# EAGLE design sensor (EAGLE 6.4)
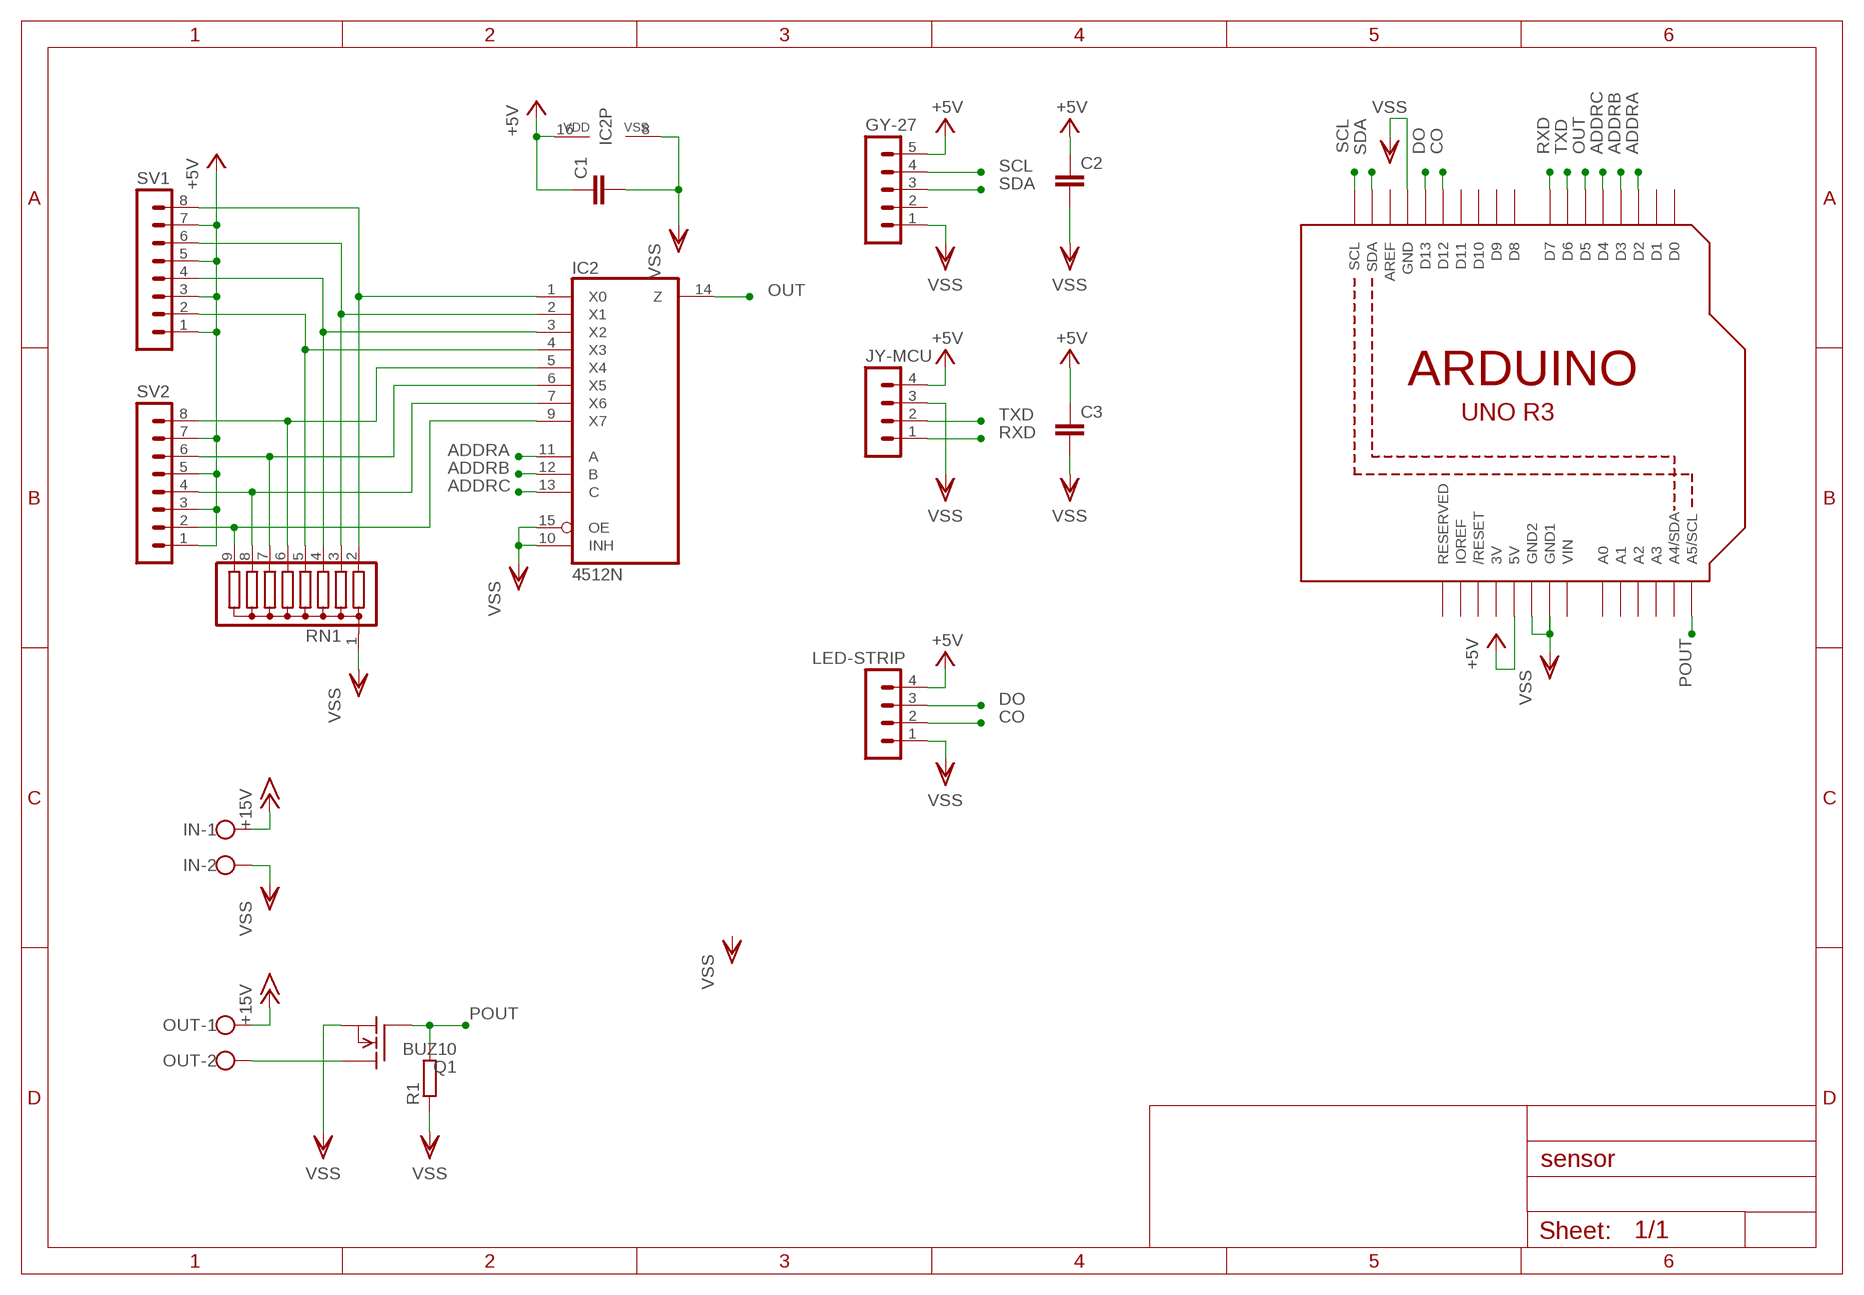
[diagram p0: schematic, sheet 1]

## Parts
C1  C-EUC0805  [C0805]
C2  C-EUC0805  [C0805]
C3  C-EUC0805  [C0805]
GY-27  MA05-1  [MA05-1]
IC2  4512N  [DIL16]
IN  W237-102  [W237-102]
JY-MCU  MA04-1  [MA04-1]
LED-STRIP  MA04-1  [MA04-1]
OUT  W237-102  [W237-102]
Q1  BUZ10  [TO220]
R1  R-EU_M0805  [M0805]
RN1  G08R  [SIL9]
SV1  MA08-1W  [MA08-1W]
SV2  MA08-1W  [MA08-1W]
U1  ARDUINOR3-DIMENSION  [ARDUINOR3]

## Nets
+5V: C1.1 C2.1 C3.1 GY-27.5 IC2.16(VDD) JY-MCU.4 LED-STRIP.4 SV1.1 SV1.3 SV1.5 SV1.7 SV2.1 SV2.3 SV2.5 SV2.7 U1.5V
+15V: IN.1 OUT.1
ADDRA: IC2.11(A) U1.D2
ADDRB: IC2.12(B) U1.D3
ADDRC: IC2.13(C) U1.D4
CO: LED-STRIP.2 U1.D12
DO: LED-STRIP.3 U1.D13
N$1: IC2.5(X4) RN1.6 SV2.8
N$2: IC2.4(X3) RN1.5 SV1.2
N$3: IC2.3(X2) RN1.4 SV1.4
N$4: IC2.6(X5) RN1.7 SV2.6
N$5: IC2.2(X1) RN1.3 SV1.6
N$6: IC2.1(X0) RN1.2 SV1.8
N$7: IC2.9(X7) RN1.9 SV2.2
N$9: IC2.7(X6) RN1.8 SV2.4
N$13: OUT.2 Q1.2(D)
OUT: IC2.14(Z) U1.D5
POUT: Q1.1(G) R1.2 U1.A5(A5/SCL)
RXD: JY-MCU.1 U1.D7
SCL: GY-27.4 U1.SCL
SDA: GY-27.3 U1.SDA
TXD: JY-MCU.2 U1.D6
VSS: C1.2 C2.2 C3.2 GY-27.1 IC2.8(VSS) IC2.10(INH) IC2.15(OE) IN.2 JY-MCU.3 LED-STRIP.1 Q1.3(S) R1.1 RN1.1 U1.GND U1.GND1 U1.GND2
Unconnected: GY-27.2 U1.A0 U1.A1 U1.A2 U1.A3 U1.A4(A4/SDA) U1.AREF U1.D0 U1.D1 U1.D8 U1.D9 U1.D10 U1.D11 U1.IOREF U1.RESERVED U1.RESET(/RESET)

## Power pins joined to a net without a drawn wire
3V: U1.3V
VIN: U1.VIN

## Library data of the parts
C1-C3 = rcl:C-EU: CAPACITOR, European symbol
GY-27 = con-lstb:MA05-1: PIN HEADER; OC_FARNELL: unknown; OC_NEWARK: unknown
IC2 = 45xx:4512: 8-channel DATA SELECTOR Inhibit function corrected - 2005.10.04 librarian@cadsoft.de
IN OUT = con-wago-500:W237-102: WAGO SCREW CLAMP; MPN: 237-102; OC_FARNELL: unknown; OC_NEWARK: 70K9898
JY-MCU LED-STRIP = con-lstb:MA04-1: PIN HEADER; OC_FARNELL: unknown; OC_NEWARK: unknown
Q1 = transistor-fet:BUZ10: N-Channel Enhancement MOSFET 50V; 20A; 0,080Ohm
R1 = rcl:R-EU_: RESISTOR, European symbol
RN1 = resistor-sil:G08R: SIL RESISTOR; OC_FARNELL: unknown; OC_NEWARK: unknown
SV1 SV2 = con-lstb:MA08-1W: PIN HEADER; OC_FARNELL: unknown; OC_NEWARK: unknown
U1 = adafruit:ARDUINOR3: This is a new object for the new Arduino R3 - with extra pins that you may want to use (such as IOref, and duplicated A4/A5

## Net classes
0 default: clearance 0.355 mm

## Board
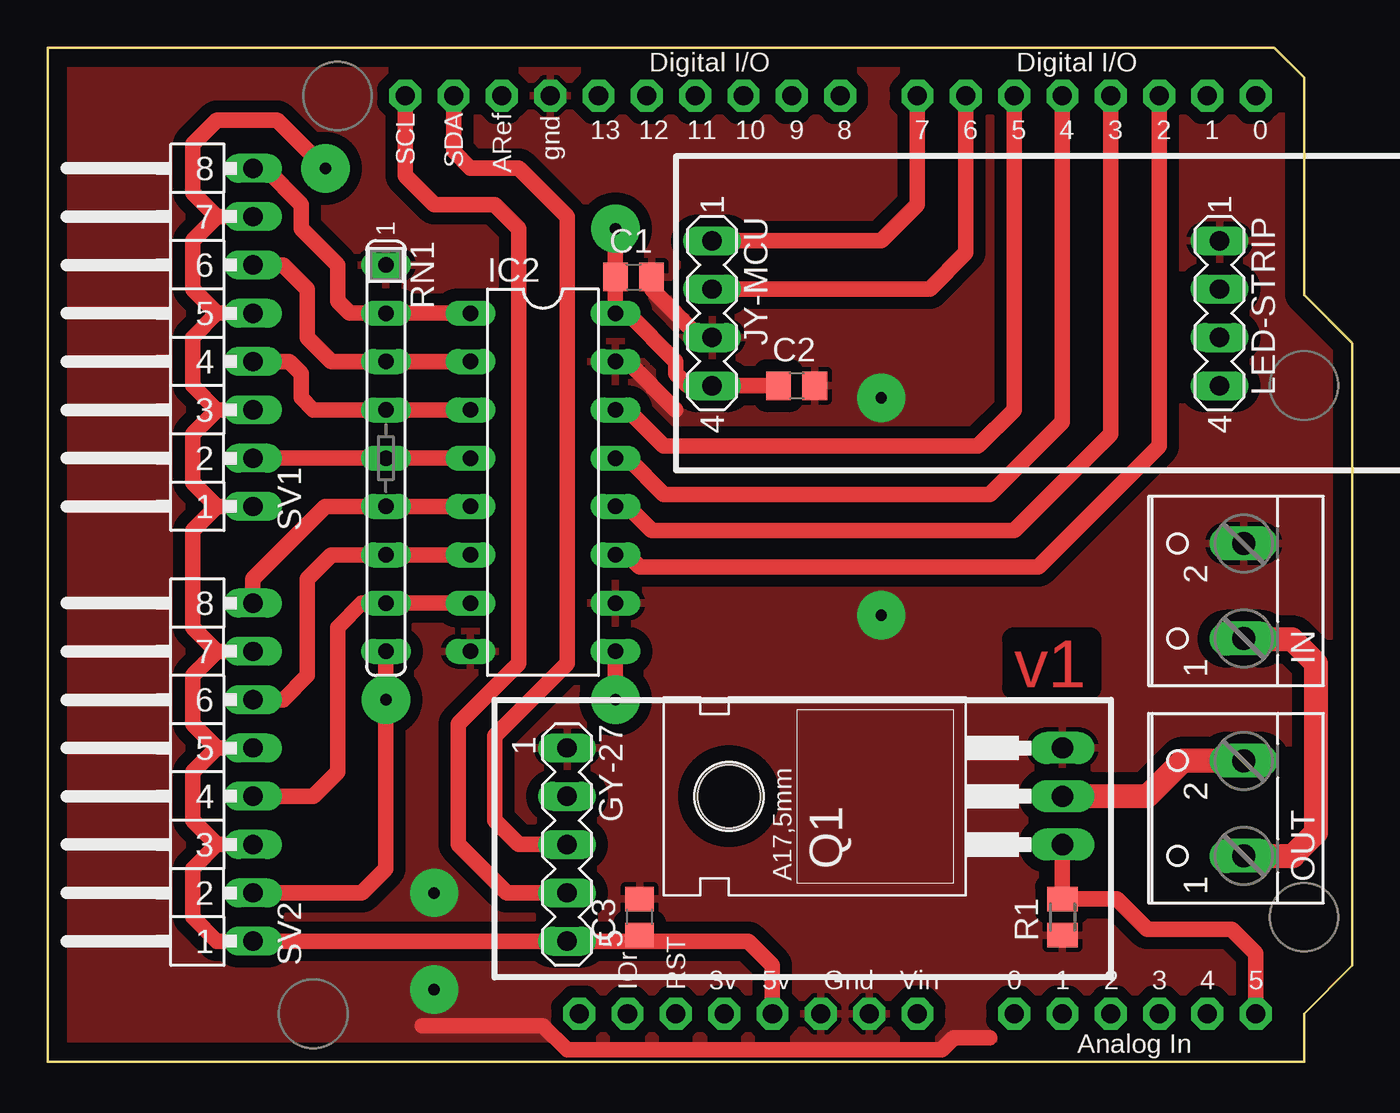
[diagram p1: board, top side]
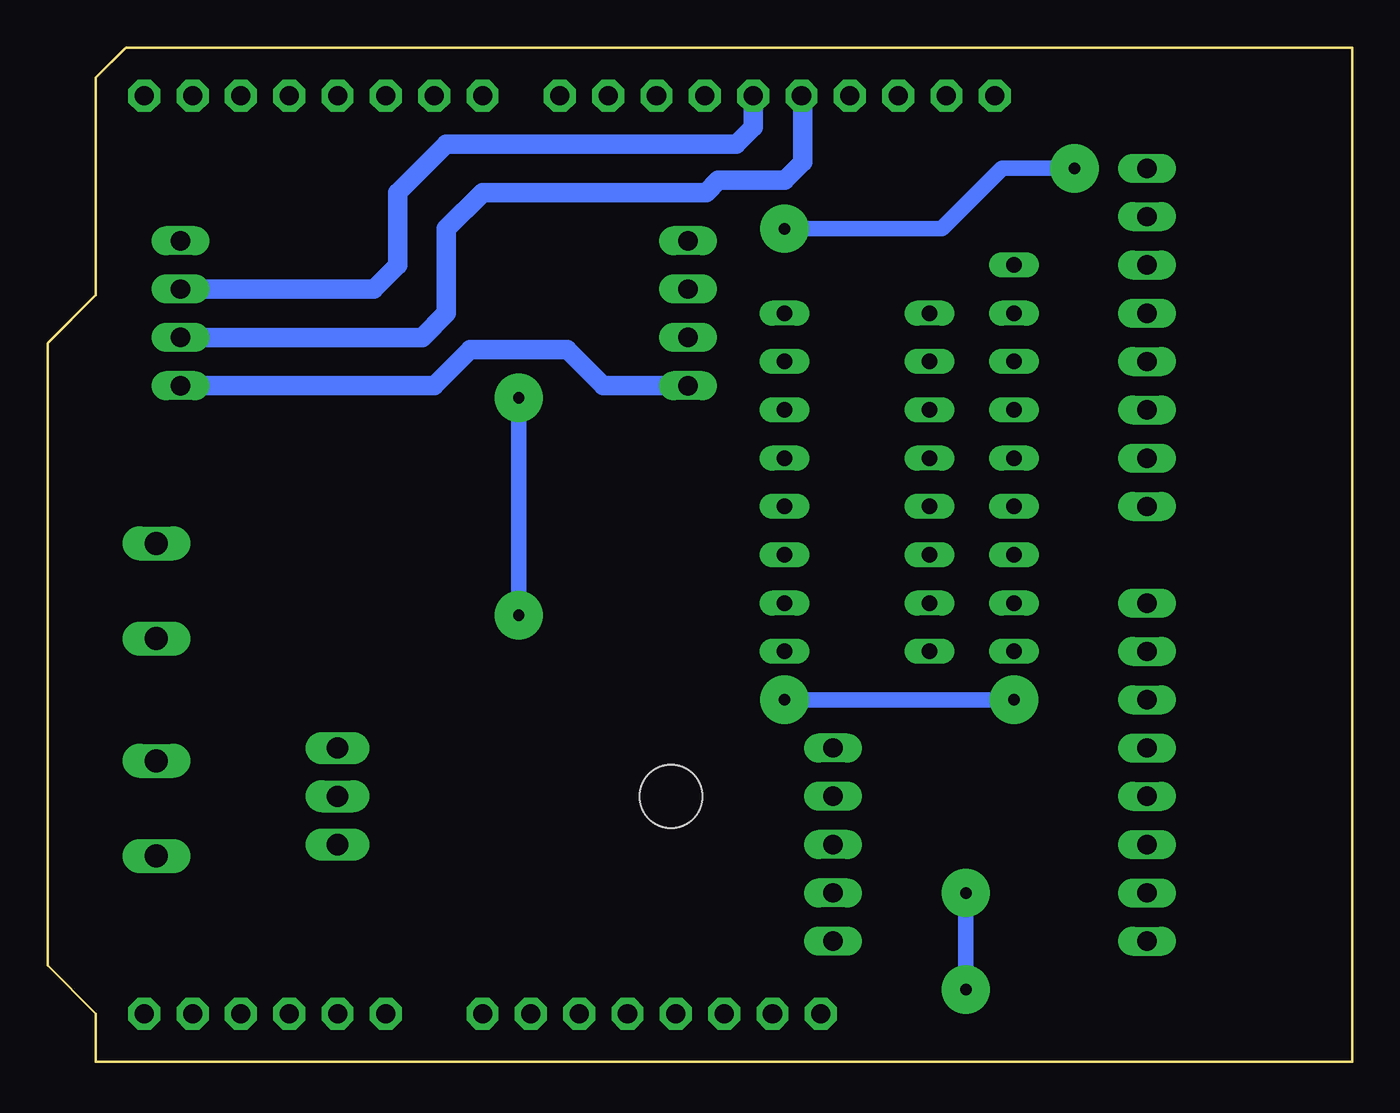
[diagram p2: board, bottom side, seen from below]

Size 68.58 x 53.34 mm. Coordinates in mm from the lower left corner, seen from the top.
Copper layers (1*16): Top 0.035mm / dielectric 1.5mm / Bottom 0.035mm
Design rules "default": minimum track width 10mil, minimum drill 24mil, track to track 8mil, track to pad 8mil, pad to pad 8mil, via to via 8mil, smd to smd 8mil, copper to edge 40mil, drill to drill 8mil, minimum pad ring 10mil, minimum via ring 8mil, stop-mask expansion 4mil, vias tented up to drill 0mil, thermal gap 10mil
Milling: 9 lines

### Footprints (pad centres in the part's own frame; a part is rotated, then mirrored left to right if it is on the bottom)
C0805 = smd 1.3 x 1.5: 1 -0.95,0; 2 0.95,0
MA05-1 = drill 1.016 long: 1 -5.08,0; 2 -2.54,0; 3 0,0; 4 2.54,0; 5 5.08,0
DIL16 = drill 0.813 long: 1 -8.89,-3.81; 2 -6.35,-3.81; 3 -3.81,-3.81; 4 -1.27,-3.81; 5 1.27,-3.81; 6 3.81,-3.81; 7 6.35,-3.81; 8 8.89,-3.81; 9 8.89,3.81; 10 6.35,3.81; 11 3.81,3.81; 12 1.27,3.81; 13 -1.27,3.81; 14 -3.81,3.81; 15 -6.35,3.81; 16 -8.89,3.81
W237-102 = drill 1.194 long: 1 -2.5,-1.27; 2 2.5,-1.27
MA04-1 = drill 1.016 long: 1 -3.81,0; 2 -1.27,0; 3 1.27,0; 4 3.81,0
TO220 = drill 1.118 long: 1 -2.54,-6.35; 2 0,-6.35; 3 2.54,-6.35 | hole 3.302: 0,11.176
M0805 = smd 1.3 x 1.6: 1 -0.95,0; 2 0.95,0
SIL9 = drill 0.813 long: 1 -10.16,0; 2 -7.62,0; 3 -5.08,0; 4 -2.54,0; 5 0,0; 6 2.54,0; 7 5.08,0; 8 7.62,0; 9 10.16,0
MA08-1W = drill 1.016 long: 1 -8.89,0; 2 -6.35,0; 3 -3.81,0; 4 -1.27,0; 5 1.27,0; 6 3.81,0; 7 6.35,0; 8 8.89,0
ARDUINOR3 = drill 1 pad 1.676 octagon: 3V 35.56,2.54; 5V 38.1,2.54; A0 50.8,2.54; A1 53.34,2.54; A2 55.88,2.54; A3 58.42,2.54; A4 60.96,2.54; A5 63.5,2.54; AREF 23.876,50.8; D0 63.5,50.8; D1 60.96,50.8; D2 58.42,50.8; D3 55.88,50.8; D4 53.34,50.8; D5 50.8,50.8; D6 48.26,50.8; D7 45.72,50.8; D8 41.656,50.8; D9 39.116,50.8; D10 36.576,50.8; D11 34.036,50.8; D12 31.496,50.8; D13 28.956,50.8; GND 26.416,50.8; GND1 43.18,2.54; GND2 40.64,2.54; IOREF 30.48,2.54; RESERVED 27.94,2.54; RESET 33.02,2.54; SCL 18.796,50.8; SDA 21.336,50.8; VIN 45.72,2.54

### Placement (x,y rotation side)
C1  30.8,41.27 0 top
C2  39.37,35.56 0 top
C3  31.11,7.62 90 top
GY-27  27.3,11.43 270 top
IC2  26.04,30.48 270 top
IN  61.59,24.77 90 top
JY-MCU  34.92,39.37 270 top
LED-STRIP  61.59,39.37 270 top
OUT  61.59,13.34 90 top
Q1  46.99,13.97 90 top
R1  53.34,7.62 90 top
RN1  17.78,31.75 270 top
SV1  10.79,38.1 90 top
SV2  10.79,15.24 90 top
U1  0,0 0 top

### Tracks (layer width: path | path; a pad name or v marks a point on that pad's centre or on a via)
+5V  (via drill 0.6 pad 2.54)
  Top 0.813: 8.89,11.43 7.62,10.16 7.62,7.62 8.89,6.35 SV2.1 GY-27.5 | 8.89,11.43 7.62,12.7 7.62,15.24 8.89,16.51 | 8.89,16.51 7.62,17.78 7.62,20.32 8.89,21.59 | 8.89,21.59 7.62,22.86 7.62,27.94 8.89,29.21 | 8.89,29.21 7.62,30.48 7.62,33.02 8.89,34.29 | 8.89,34.29 7.62,35.56 7.62,38.1 8.89,39.37 | 8.89,39.37 7.62,40.64 7.62,43.18 8.89,44.45 | 8.89,39.37 SV1.5 | 8.89,34.29 SV1.3 | 8.89,29.21 SV1.1 | 8.89,21.59 SV2.7 | 8.89,16.51 SV2.5 | 8.89,11.43 SV2.3 | U1.5V 38.1,5.08 36.83,6.35 GY-27.5 | C2.1 JY-MCU.4 33.66,35.56 33.02,36.2 33.02,36.83 30.48,39.37 IC2.16 | GY-27.5 30.8,6.35 C3.1 | SV1.7 8.89,44.45 | 8.89,44.45 7.62,45.72 7.62,48.26 8.89,49.53 12.06,49.53 v14.61,46.99 | v29.84,43.81 IC2.16 | C1.1 IC2.16
  Bottom 0.813: v14.61,46.99 18.41,46.99 21.59,43.81 v29.84,43.81
  Bottom 1.016: LED-STRIP.4 48.26,35.56 46.35,37.47 41.27,37.47 39.37,35.56 JY-MCU.4
+15V
  Top 1.27: OUT.1 65.44,10.84 66.67,12.06 66.67,20.95 65.41,22.23 62.91,22.23 IN.1
ADDRA
  Top 0.813: U1.D2 58.42,32.38 52.07,26.04 31.11,26.04 30.48,26.67 IC2.11
ADDRB
  Top 0.813: IC2.12 30.48,29.21 31.75,27.94 50.8,27.94 55.88,33.02 U1.D3
ADDRC
  Top 0.813: U1.D4 53.34,33.66 49.53,29.84 32.38,29.84 30.48,31.75 IC2.13
CO
  Bottom 1.016: LED-STRIP.2 51.44,40.64 50.16,41.91 50.16,45.72 47.62,48.26 32.38,48.26 31.5,49.15 U1.D12
DO
  Bottom 1.016: U1.D13 28.89,50.74 28.89,47.31 29.84,46.35 33.34,46.35 33.97,45.72 45.72,45.72 47.62,43.81 47.62,39.37 48.9,38.1 LED-STRIP.3
N$1
  Top 0.813: IC2.5 RN1.6 14.61,29.21 10.79,25.4 SV2.8
N$2
  Top 0.813: SV1.2 RN1.5 IC2.4
N$3
  Top 0.813: IC2.3 RN1.4 13.97,34.29 13.34,34.92 13.34,36.2 12.7,36.83 SV1.4
N$4
  Top 0.813: IC2.6 RN1.7 15.24,26.67 14.92,26.67 13.65,25.4 13.65,20.32 12.38,19.05 SV2.6
N$5
  Top 0.813: IC2.2 RN1.3 14.92,36.83 13.65,38.1 13.65,40.64 12.38,41.91 SV1.6
N$6
  Top 0.813: SV1.8 11.43,46.99 13.34,45.09 13.34,43.81 15.24,41.91 15.24,40.01 15.88,39.37 RN1.2 IC2.1
N$7  (via drill 0.6 pad 2.54)
  Top 0.813: SV2.2 16.51,8.89 17.78,10.16 v17.78,19.05 RN1.9 | IC2.9 v29.84,19.05
  Bottom 0.813: v29.84,19.05 v17.78,19.05
N$9
  Top 0.813: SV2.4 13.97,13.97 15.24,15.24 15.24,22.86 16.51,24.13 RN1.8 IC2.7
N$10  (via drill 0.6 pad 2.54)
  other vias: 29.84,19.05
N$13
  Top 1.27: OUT.2 59.65,15.84 57.78,13.97 Q1.2
OUT
  Top 0.813: IC2.14 30.48,34.29 32.38,32.38 48.9,32.38 50.8,34.29 U1.D5
POUT
  Top 0.813: Q1.1 R1.2 56.2,8.57 57.78,6.99 62.23,6.99 63.5,5.71 U1.A5
RXD
  Top 0.813: U1.D7 45.72,45.09 43.81,43.18 JY-MCU.1
SCL
  Top 0.813: U1.SCL 18.8,46.61 20.32,45.09 23.5,45.09 24.77,43.81 24.77,20.95 21.59,17.78 21.59,11.43 24.13,8.89 GY-27.4
SDA
  Top 0.813: U1.SDA 21.34,47.88 22.23,46.99 24.77,46.99 27.3,44.45 27.3,20.95 23.5,17.14 23.5,12.7 24.77,11.43 GY-27.3
TXD
  Top 0.813: U1.D6 48.26,42.55 46.35,40.64 JY-MCU.2
VSS  (via drill 0.6 pad 2.54)
  Top 0.813: 19.68,1.91 26.04,1.91 27.3,0.64 46.99,0.64 47.62,1.27 49.53,1.27 | IC2.15 30.48,36.83 33.02,34.29 | JY-MCU.3 34.29,38.1 31.75,40.64
  Bottom 0.813: v43.81,34.92 v43.81,23.5 | v20.32,8.89 v20.32,3.81
  pour Top (isolate 0.635): 0.64,52.7 64.14,52.7 65.41,51.44 65.41,40.01 67.94,37.47 67.94,5.71 65.41,3.17 65.41,0.64 0.64,0.64

### Text on the board
Top: v1